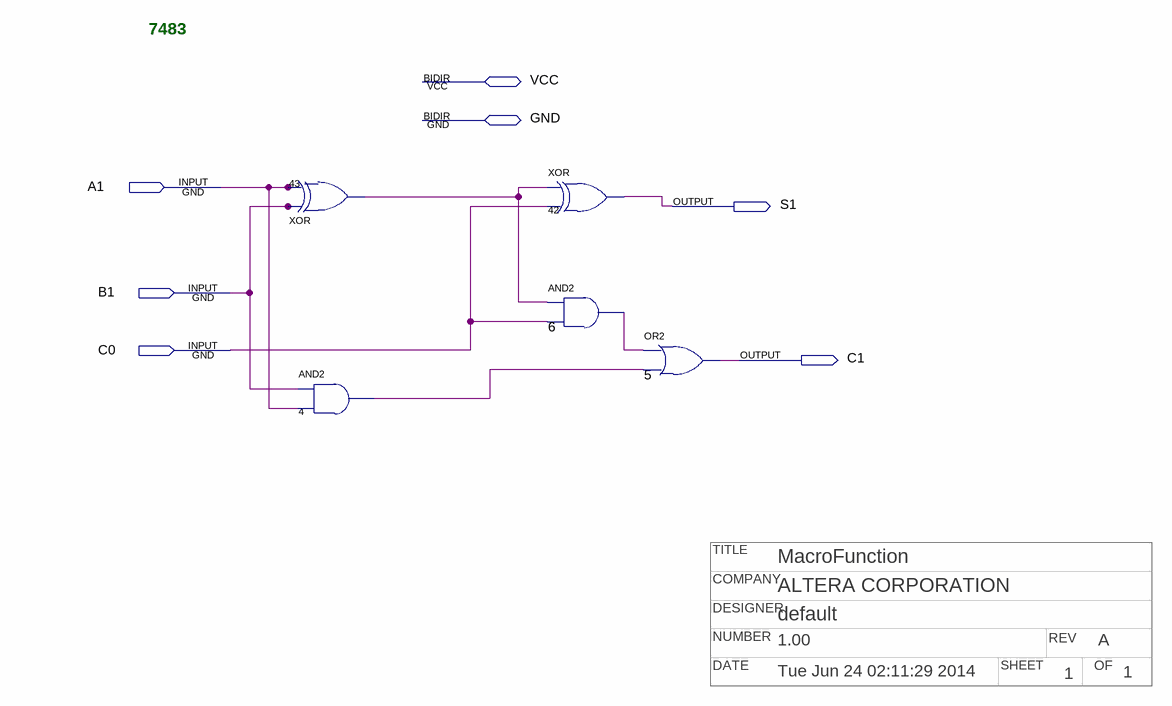
[diagram p0: schematic sheet]
// Quartus schematic np7483.bdf as structural Verilog: 5 symbols, 7 pins
// Title block: TITLE: MacroFunction; COMPANY: ALTERA CORPORATION; DESIGNER: default; NUMBER: 1.00; REV: A; DATE: Tue Jun 24 02:11:29 2014; SHEET: 1; OF: 1
module np7483 (
  input  A1,
  input  B1,
  input  C0,
  inout  VCC,
  inout  GND,
  output S1,
  output C1
);

  wire n4_out, n6_out, n43_out;

  xor u_43 (n43_out, B1, A1);
  and u_4 (n4_out, B1, A1);
  xor u_42 (S1, n43_out, C0);
  and u_6 (n6_out, n43_out, C0);
  or u_5 (C1, n6_out, n4_out);

  // Notes on the sheet:
  //   7483
endmodule
